# EAGLE design AstroEQ (EAGLE 6.0)
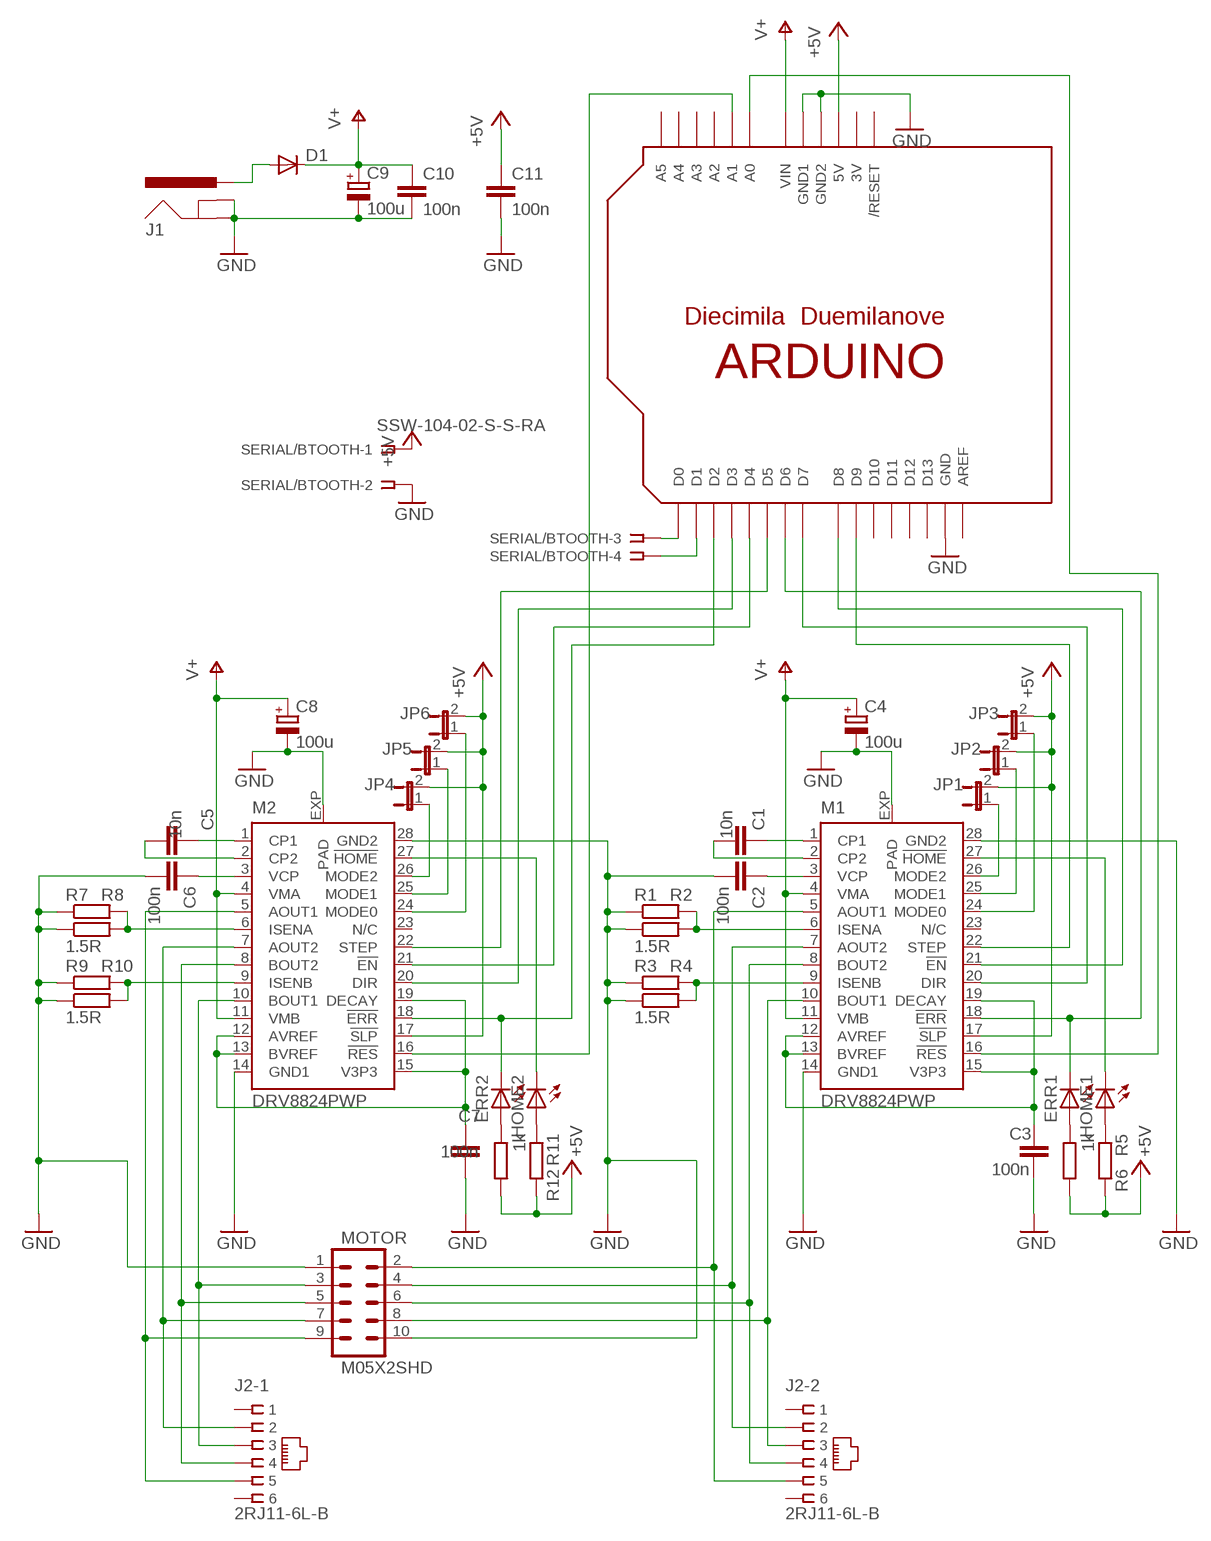
[diagram p0: schematic, sheet 1]

## Parts
C1  10n  C-EUC0603K  [C0603K]
C2  100n  C-EUC0603K  [C0603K]
C3  100n  C-EUC0603K  [C0603K]
C4  100u  CPOL-EUC/6032-28R  [C/6032-28R]
C5  10n  C-EUC0603K  [C0603K]
C6  100n  C-EUC0603K  [C0603K]
C7  100n  C-EUC0603K  [C0603K]
C8  100u  CPOL-EUC/6032-28R  [C/6032-28R]
C9  100u  CPOL-EUC/6032-28R  [C/6032-28R]
C10  100n  C-EUC0603K  [C0603K]
C11  100n  C-EUC0603K  [C0603K]
D1  DIODESMA-ALT  [SMA-DIODE_ALT]
ERR1  LEDCHIP-LED0603  [CHIP-LED0603]
ERR2  LEDCHIP-LED0603  [CHIP-LED0603]
HOME1  LEDCHIP-LED0603  [CHIP-LED0603]
HOME2  LEDCHIP-LED0603  [CHIP-LED0603]
J1  POWER_JACKPTH  [POWER_JACK_PTH]
J2  2RJ11-6L-B  [2RJ11]
JP1  JUMPER-2SMD-NO  [SJ_2S-NO]
JP2  JUMPER-2SMD-NO  [SJ_2S-NO]
JP3  JUMPER-2SMD-NO  [SJ_2S-NO]
JP4  JUMPER-2SMD-NO  [SJ_2S-NO]
JP5  JUMPER-2SMD-NO  [SJ_2S-NO]
JP6  JUMPER-2SMD-NO  [SJ_2S-NO]
M1  DRV8824PWP  [HTSSOP28PWP]
M2  DRV8824PWP  [HTSSOP28PWP]
MOTOR  M05X2SHD  [2X5-SHROUDED]
R1  1.5R  R-EU_R2512  [R2512]
R2  1.5R  R-EU_R2512  [R2512]
R3  1.5R  R-EU_R2512  [R2512]
R4  1.5R  R-EU_R2512  [R2512]
R5  1k  R-EU_R0603  [R0603]
R6  1k  R-EU_R0603  [R0603]
R7  1.5R  R-EU_R2512  [R2512]
R8  1.5R  R-EU_R2512  [R2512]
R9  1.5R  R-EU_R2512  [R2512]
R10  1.5R  R-EU_R2512  [R2512]
R11  1k  R-EU_R0603  [R0603]
R12  1k  R-EU_R0603  [R0603]
SERIAL/BTOOTH  SSW-104-02-S-S-RA  [SSW-104-02-S-S-RA]
U$1  ARDUINOUNO  [ARDUINO]

## Nets
3.3V-1: C3.1 M1.12(AVREF) M1.13(BVREF) M1.15(V3P3) M1.19(DECAY)
3.3V-2: C7.1 M2.12(AVREF) M2.13(BVREF) M2.15(V3P3) M2.19(DECAY)
!EN-1: M1.21(!EN) U$1.D8
!EN-2: M2.21(!EN) U$1.D4
!ERR-1: M1.16(!RES) U$1.A0
!ERR-2: ERR2.C M2.18(!ERR) U$1.D2
!HOME-1: HOME1.C M1.27(!HOME)
!HOME-2: HOME2.C M2.27(!HOME)
!RST-1: ERR1.C M1.18(!ERR) U$1.D6
!RST-2: M2.16(!RES) U$1.A1
+5V: C11.1 JP1.2 JP2.2 JP3.2 JP4.2 JP5.2 JP6.2 M1.17(!SLP) M2.17(!SLP) R5.2 R6.2 R11.2 R12.2 SERIAL/BTOOTH.1 U$1.5V
A1-1: J2.2-5 M1.5(AOUT1) MOTOR.2
A1-2: J2.1-5 M2.5(AOUT1) MOTOR.9
A2-1: J2.2-2 M1.7(AOUT2) MOTOR.4
A2-2: J2.1-2 M2.7(AOUT2) MOTOR.7
B1-1: J2.2-3 M1.10(BOUT1) MOTOR.8
B1-2: J2.1-3 M2.10(BOUT1) MOTOR.3
B2-1: J2.2-4 M1.8(BOUT2) MOTOR.6
B2-2: J2.1-4 M2.8(BOUT2) MOTOR.5
CP1-1: C1.1 M1.1(CP1)
CP1-2: C5.1 M2.1(CP1)
CP2-1: C1.2 M1.2(CP2)
CP2-2: C5.2 M2.2(CP2)
DIR-1: M1.20(DIR) U$1.D7
DIR-2: M2.20(DIR) U$1.D3
GND: C2.2 C3.2 C4.- C6.2 C7.2 C8.- C9.- C10.2 C11.2 J1.GND J1.GNDBREAK M1.14(GND1) M1.28(GND2) M1.EXP(PAD) M2.14(GND1) M2.28(GND2) M2.EXP(PAD) MOTOR.1 MOTOR.10 R1.1 R2.1 R3.1 R4.1 R7.1 R8.1 R9.1 R10.1 SERIAL/BTOOTH.2 U$1.GND U$1.GND1 U$1.GND2
ISENA-1: M1.6(ISENA) R1.2 R2.2
ISENA-2: M2.6(ISENA) R7.2 R8.2
ISENB-1: M1.9(ISENB) R3.2 R4.2
ISENB-2: M2.9(ISENB) R9.2 R10.2
LED1: ERR1.A R6.1
LED2: HOME1.A R5.1
LED3: ERR2.A R12.1
LED4: HOME2.A R11.1
M0-1: JP3.1 M1.24(MODE0)
M0-2: JP6.1 M2.24(MODE0)
M1-1: JP2.1 M1.25(MODE1)
M1-2: JP5.1 M2.25(MODE1)
M2-1: JP1.1 M1.26(MODE2)
M2-2: JP4.1 M2.26(MODE2)
N$7: D1.A J1.PWR
RX: SERIAL/BTOOTH.3 U$1.D0
STEP-1: M1.22(STEP) U$1.D9
STEP-2: M2.22(STEP) U$1.D5
TX: SERIAL/BTOOTH.4 U$1.D1
V+: C4.+ C8.+ C9.+ C10.1 D1.C M1.4(VMA) M1.11(VMB) M2.4(VMA) M2.11(VMB) U$1.VIN
VCP-1: C2.1 M1.3(VCP)
VCP-2: C6.1 M2.3(VCP)
Unconnected: J2.1-1 J2.1-6 J2.2-1 J2.2-6 M1.23(N/C) M2.23(N/C) U$1.A2 U$1.A3 U$1.A4 U$1.A5 U$1.AREF U$1.D10 U$1.D11 U$1.D12 U$1.D13 U$1.RESET(/RESET)

## Power pins joined to a net without a drawn wire
3V: U$1.3V

## Library data of the parts
C1-C3 C5-C7 C10 C11 = resistor:C-EU: CAPACITOR, European symbol
C4 C8 C9 = resistor:CPOL-EU: POLARIZED CAPACITOR, European symbol
D1 = SparkFun:DIODE: Diode These are standard reverse protection diodes and small signal diodes. SMA package can handle up to about 1A. SOD-323 can handle about 200mA. What the SOD-323 package when ordering, there are some mfgs out there that are 5-pin packages.
ERR1 ERR2 HOME1 HOME2 = led:LED: LED OSRAM: - CHIPLED LG R971, LG N971, LY N971, LG Q971, LY Q971, LO R971, LY R971 LH N974, LH R974 LS Q976, LO Q976, LY Q976 LO Q996 - Hyper CHIPLED LW Q18S LB Q993, LB Q99A, LB R99A - SideLED LS A670, LO A670, LY A670, LG A670, LP A670 LB A673, LV A673, LT A673, LW A673 LH A674 LY A675 LS A676, LA A676, LO A676, LY A676, LW A676 LS A679, LY A679, LG A679 - Hyper Micro SIDELED® LS Y876, LA Y876, LO Y876, LY Y876 LT Y87S - SmartLED LW L88C, LW L88S LB L89C, LB L89S, LG L890 LS L89K, LO L89K, LY L89K LS L896, LA L896, LO L896, LY L896 - TOPLED LS T670, LO T670, LY T670, LG T670, LP T670 LSG T670, LSP T670, LSY T670, LOP T670, LYG T670 LG T671, LOG T671, LSG T671 LB T673, LV T673, LT T673, LW T673 LH T674 LS T676, LA T676, LO T676, LY T676, LB T676, LH T676, LSB T676, LW T676 LB T67C, LV T67C, LT T67C, LS T67K, LO T67K, LY T67K, LW E67C LS E67B, LA E67B, LO E67B, LY E67B, LB E67C, LV E67C, LT E67C LW T67C LS T679, LY T679, LG T679 LS T770, LO T770, LY T770, LG T770, LP T770 LB T773, LV T773, LT T773, LW T773 LH T774 LS E675, LA E675, LY E675, LS T675 LS T776, LA T776, LO T776, LY T776, LB T776 LHGB T686 LT T68C, LB T68C - Hyper Mini TOPLED® LB M676 - Mini TOPLED Santana® LG M470 LS M47K, LO M47K, LY M47K Source: http://www.osram.convergy.de LUXEON: - LUMILED® LXK2-PW12-R00, LXK2-PW12-S00, LXK2-PW14-U00, LXK2-PW14-V00 LXK2-PM12-R00, LXK2-PM12-S00, LXK2-PM14-U00 LXK2-PE12-Q00, LXK2-PE12-R00, LXK2-PE12-S00, LXK2-PE14-T00, LXK2-PE14-U00 LXK2-PB12-K00, LXK2-PB12-L00, LXK2-PB12-M00, LXK2-PB14-N00, LXK2-PB14-P00, LXK2-PB14-Q00 LXK2-PR12-L00, LXK2-PR12-M00, LXK2-PR14-Q00, LXK2-PR14-R00 LXK2-PD12-Q00, LXK2-PD12-R00, LXK2-PD12-S00 LXK2-PH12-R00, LXK2-PH12-S00 LXK2-PL12-P00, LXK2-PL12-Q00, LXK2-PL12-R00 Source: www.luxeon.com KINGBRIGHT: KA-3528ASYC Source: www.kingbright.com
J1 = SparkFun:POWER_JACK: Power Jack This is the standard 5.5mm barrel jack for power. The PTH is the most common, proven, reliable, footprint. All others are experimental. The Slot footprint only works if the mill layer is transmitted to the PCB fab house so be warned. Spark Fun Electronics SKU : PRT-00119. Mating wall wart : TOL-00298 (and others)
J2 = con-tycoelectronics:2RJ11-6L-B: CORCOM Modular RJ Jacks L - Ganged Series Source: www.tycoelectronics.com .. ENG_DS_1654001_1099_RJ_L_0507.pdf; MF: TYCO ELECTRONICS; MPN: 2RJ11-6L-B; OC_FARNELL: unknown; OC_NEWARK: 48F3954
JP1-JP6 = SparkFun:JUMPER-2: Jumper Basic 0.1" spaced jumper. Use with breakaway headers.
M1 M2 = texas:DRV8824
MOTOR = SparkFun:M05X2: Header 5x2 Standard 10-pin dual row 0.1" header. Commonly used with AVR-ISP. Use with Spark Fun Electronics SKU: PRT-00778
R1-R12 = resistor:R-EU_: RESISTOR, European symbol
SERIAL/BTOOTH = con-samtec:SSW-104-02-S-S: THROUGH-HOLE .025" SQ POST SOCKET Source: Samtec SSW.pdf; MPN: SSW-104-02-S-S-RA; OC_FARNELL: unknown; OC_NEWARK: 11P9385
U$1 = adafruit:ARDUINO: Arduino Diecimila/Duemilanove Make a shield with ease, this package has all the named pins as well as the two mounting drill holes and an outline of the USB and DC power connector. The outline is on the DIMENSION layer, so if your board house uses it they will cut the outline to match. http://www.ladyada.net/library/pcb/eaglelibrary.html

## Board
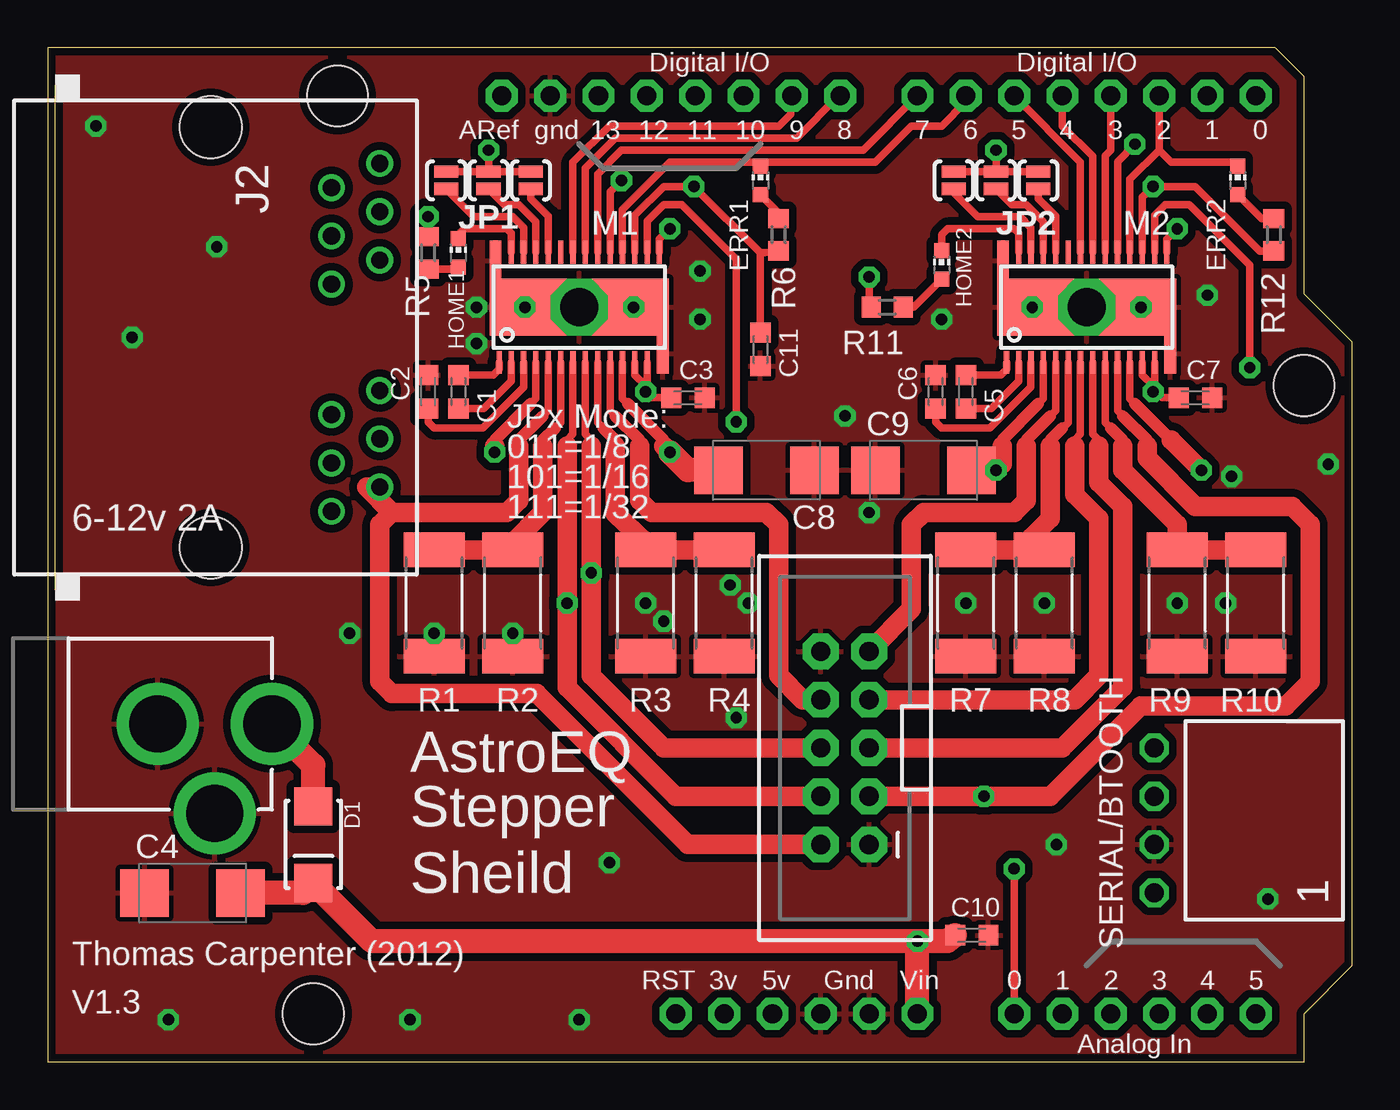
[diagram p1: board, top side]
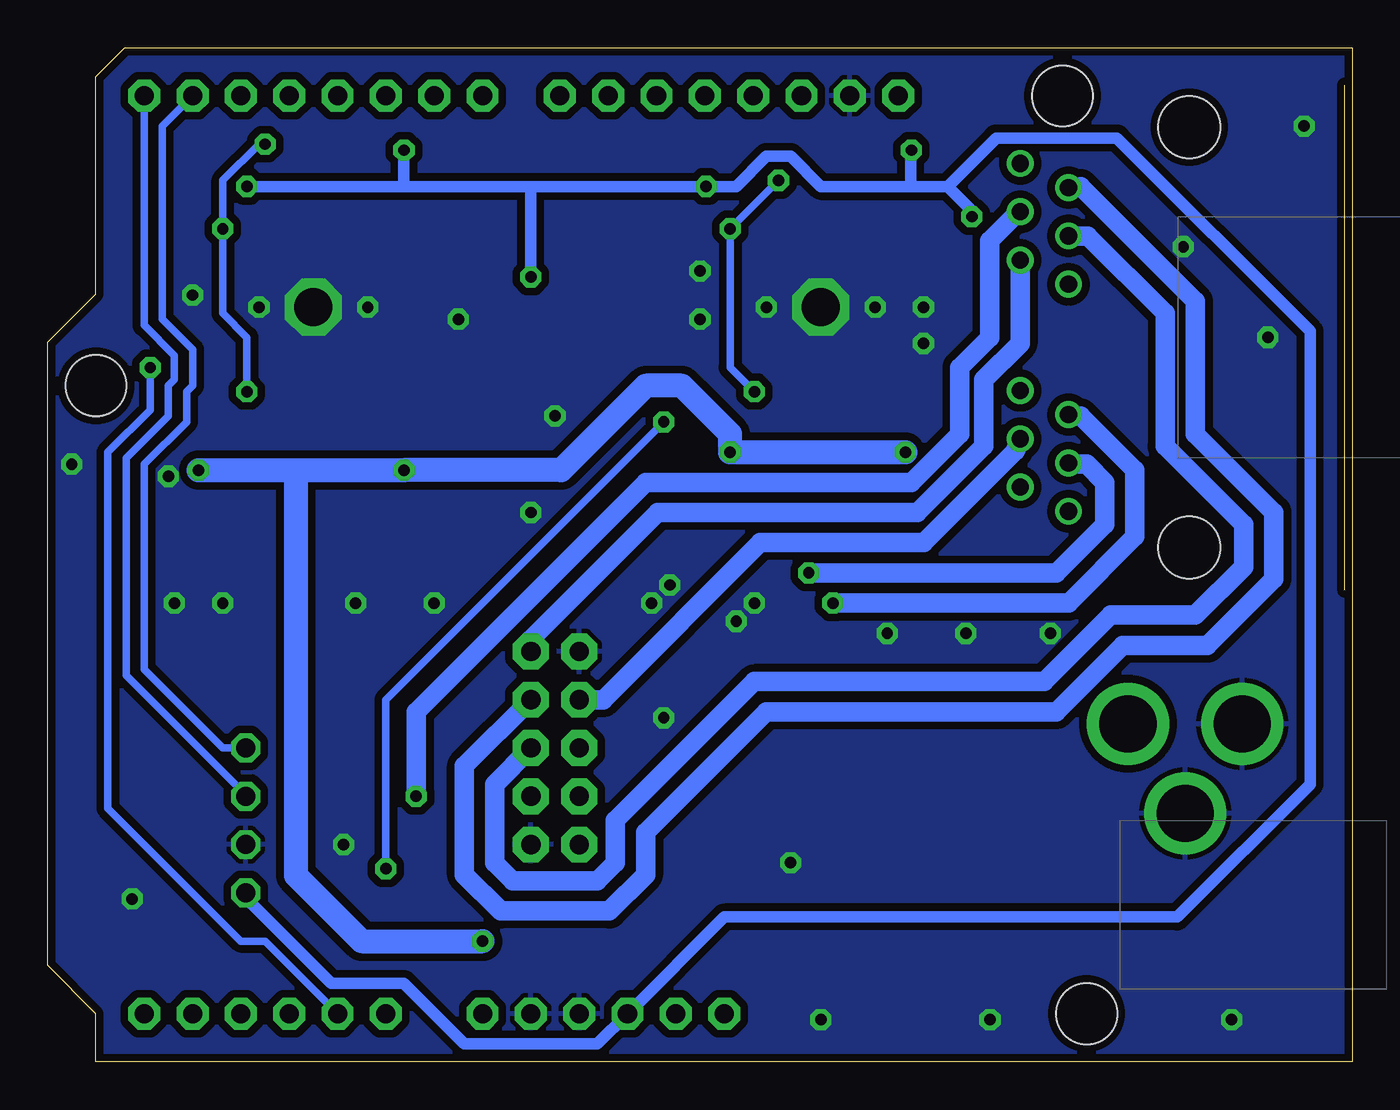
[diagram p2: board, bottom side, seen from below]

Size 68.58 x 53.34 mm. Coordinates in mm from the lower left corner, seen from the top.
Copper layers (1*16): Top 0.035mm / dielectric 1.5mm / Bottom 0.035mm
Design rules: minimum track width 0.2mm, minimum drill 0.4mm, track to track 0.2mm, track to pad 0.2mm, pad to pad 0.2mm, via to via 0.2mm, smd to smd 0mil, copper to edge 10mil, drill to drill 0.2mm, minimum pad ring 10mil, minimum via ring 10mil, stop-mask expansion 0.125mm, vias tented up to drill 0mil, thermal gap 10mil

### Footprints (pad centres in the part's own frame; a part is rotated, then mirrored left to right if it is on the bottom)
C0603K = smd 1.05 x 1.08: 1 -0.875,0; 2 0.875,0
C/6032-28R = smd 2.55 x 2.5: + 2.525,0; - -2.525,0
SMA-DIODE_ALT = smd 2 x 2: A -2,0; C 2,0
CHIP-LED0603 = smd 0.8 x 0.8: A 0,-0.75; C 0,0.75
POWER_JACK_PTH = drill 2.997 pad 4.318: GND 0,7.7; GNDBREAK 4.7,10.7; PWR 0,13.7
2RJ11 = drill 0.9 pad 1.4: 1-1 -9.144,8.89; 1-2 -7.874,6.35; 1-3 -6.604,8.89; 1-4 -5.334,6.35; 1-5 -4.064,8.89; 1-6 -2.794,6.35; 2-1 2.794,8.89; 2-2 4.064,6.35; 2-3 5.334,8.89; 2-4 6.604,6.35; 2-5 7.874,8.89; 2-6 9.144,6.35 | hole 3.251: -11.049,0; 11.049,0
SJ_2S-NO = smd 0.635 x 1.27: 1 -0.45,0; 2 0.45,0
HTSSOP28PWP = smd 0.27 x 1.2: 1 -4.21,-2.9; 2 -3.575,-2.9; 3 -2.925,-2.9; 4 -2.275,-2.9; 5 -1.625,-2.9; 6 -0.975,-2.9; 7 -0.325,-2.9; 8 0.325,-2.9; 9 0.975,-2.9; 10 1.625,-2.9; 11 2.275,-2.9; 12 2.925,-2.9; 13 3.575,-2.9; 15 4.21,2.9; 16 3.575,2.9; 17 2.925,2.9; 18 2.275,2.9; 19 1.625,2.9; 20 0.975,2.9; 21 0.325,2.9; 22 -0.325,2.9; 23 -0.975,2.9; 24 -1.625,2.9; 25 -2.275,2.9; 26 -2.925,2.9; 27 -3.575,2.9 | smd 0.61 x 2.1: 14 4.395,-2.45; 28 -4.395,2.45 | smd 9.4 x 3: EXP 0,0
2X5-SHROUDED = drill 1.016 pad 1.88 octagon: 1 -1.27,5.08; 2 1.27,5.08; 3 -1.27,2.54; 4 1.27,2.54; 5 -1.27,0; 6 1.27,0; 7 -1.27,-2.54; 8 1.27,-2.54; 9 -1.27,-5.08; 10 1.27,-5.08
R2512 = smd 1.8 x 3.2: 1 -2.8,0; 2 2.8,0
R0603 = smd 1 x 1.1: 1 -0.85,0; 2 0.85,0
SSW-104-02-S-S-RA = drill 1 pad 1.5 octagon: 1 -3.81,1.524; 2 -1.27,1.524; 3 1.27,1.524; 4 3.81,1.524
ARDUINO = drill 1 pad 1.676 octagon: 3V 35.56,2.54; 5V 38.1,2.54; A0 50.8,2.54; A1 53.34,2.54; A2 55.88,2.54; A3 58.42,2.54; A4 60.96,2.54; A5 63.5,2.54; AREF 23.876,50.8; D0 63.5,50.8; D1 60.96,50.8; D2 58.42,50.8; D3 55.88,50.8; D4 53.34,50.8; D5 50.8,50.8; D6 48.26,50.8; D7 45.72,50.8; D8 41.656,50.8; D9 39.116,50.8; D10 36.576,50.8; D11 34.036,50.8; D12 31.496,50.8; D13 28.956,50.8; GND 26.416,50.8; GND1 43.18,2.54; GND2 40.64,2.54; RESET 33.02,2.54; VIN 45.72,2.54 | hole 3.2: 15.24,50.8; 66.04,35.56; 13.97,2.54

### Placement (x,y rotation side)
C1  21.59,35.24 270 top
C2  20,35.24 90 top
C3  33.66,34.92 0 top
C4  7.62,8.89 0 top
C5  48.26,35.24 270 top
C6  46.67,35.24 90 top
C7  60.33,34.92 0 top
C8  37.78,31.11 180 top
C9  46.04,31.11 0 top
C10  48.58,6.67 0 top
C11  37.47,37.47 270 top
D1  13.97,11.43 270 top
ERR1  37.47,46.35 0 top
ERR2  62.55,46.35 0 top
HOME1  21.59,42.55 0 top
HOME2  46.99,41.91 0 top
J1  -1.91,17.78 270 top
J2  8.57,38.1 270 top
JP1  20.95,46.35 90 top
JP2  23.18,46.35 90 top
JP3  25.4,46.35 90 top
JP4  47.62,46.35 90 top
JP5  49.85,46.35 90 top
JP6  52.07,46.35 90 top
M1  27.94,39.69 0 top
M2  54.61,39.69 0 top
MOTOR  41.91,16.51 180 top
R1  20.32,24.13 90 top
R2  24.45,24.13 90 top
R3  31.43,24.13 90 top
R4  35.56,24.13 90 top
R5  20,42.55 90 top
R6  38.42,43.5 270 top
R7  48.26,24.13 90 top
R8  52.39,24.13 90 top
R9  59.37,24.13 90 top
R10  63.5,24.13 90 top
R11  44.13,39.69 180 top
R12  64.45,43.5 270 top
SERIAL/BTOOTH  59.69,12.7 90 top
U$1  0,0 0 top

### Tracks (layer width: path | path; a pad name or v marks a point on that pad's centre or on a via)
3.3V-1  (via drill 0.6)
  Top 0.406: M1.19 29.57,45.76 v30.16,46.35 | M1.12 30.86,36.13 31.43,35.56 v31.43,35.24 | M1.13 31.52,35.33 v31.43,35.24 | M1.15 32.15,43.26 v32.7,43.81 | v31.43,35.24 31.75,34.92 C3.1
  Bottom 0.406: v31.43,35.24 32.7,36.51 v32.7,43.81 v30.16,46.35
3.3V-2  (via drill 0.6)
  Top 0.406: M2.19 56.23,47.34 v57.15,48.26 | M2.12 57.53,36.13 58.1,35.56 v58.1,35.24 58.19,35.33 | M2.13 58.19,35.33 | M2.15 58.82,43.26 v59.37,43.81 | 58.19,35.33 58.59,34.92 C7.1
  Bottom 0.406: v57.15,48.26 57.47,48.26 59.37,46.35 v59.37,43.81 59.37,39.37 58.1,38.1 v58.1,35.24
!EN-1
  Top 0.406: M1.21 28.27,47 29.84,48.58 39.37,48.58 41.59,50.8 U$1.D8
!EN-2
  Top 0.406: M2.21 54.94,47.62 53.34,49.21 U$1.D4
!ERR-1  (via drill 0.6)
  Top 0.406: M1.16 31.52,44.22 32.38,45.09 33.34,45.09 36.2,42.23 v36.2,33.66 | v50.8,10.16 U$1.A0
  Bottom 0.406: v36.2,33.66 50.8,19.05 v50.8,10.16
!ERR-2
  Top 0.406: M2.18 56.88,46.41 58.42,47.94 | 58.42,47.94 U$1.D2 | 58.42,47.94 59.05,47.31 62.23,47.31 ERR2.C
!HOME-1
  Top 0.406: M1.27 24.36,43.58 24.13,43.81 21.91,43.81 21.59,43.5 HOME1.C
!HOME-2
  Top 0.406: M2.27 51.03,43.58 50.8,43.81 47.31,43.81 46.99,43.5 HOME2.C
!RST-1
  Top 0.406: M1.18 30.21,44.82 32.7,47.31 37.15,47.31 | 37.15,47.31 43.5,47.31 45.4,49.21 46.99,49.21 48.26,50.48 U$1.D6 | ERR1.C 37.15,47.31
!RST-2  (via drill 0.6)
  Top 0.406: M2.16 58.19,44.53 58.74,45.09 60.01,45.09 63.18,41.91 v63.18,36.51
  Bottom 0.406: v63.18,36.51 63.18,34.29 65.41,32.07 65.41,13.34 58.42,6.35 57.15,6.35 U$1.A1
+5V  (via drill 0.6)
  Top 0.406: M1.17 30.86,44.52 32.38,46.04 v33.97,46.04 37.47,42.55 | M2.17 57.53,45.47 v58.1,46.04 60.33,46.04 63.72,42.65 R12.2 | JP4.2 JP5.2 | JP6.2 JP5.2 | JP5.2 v49.85,47.94 | JP1.2 JP2.2 | JP3.2 JP2.2 | JP2.2 v23.18,47.94 | 37.47,42.55 C11.1 | R6.2 37.68,42.55 37.47,42.55 | R5.2 v20,44.45 | R11.2 43.18,39.79 v43.18,41.27
  Bottom 0.61: 43.18,46.04 v33.97,46.04 32.38,46.04 30.8,47.62 29.53,47.62 27.94,46.04 23.21,46.04 | 43.18,46.04 49.85,46.04 | 49.85,46.04 v58.1,46.04 | v49.85,47.94 49.85,46.04 | 23.21,46.04 21.27,46.04 | 23.21,46.04 23.21,47.91 v23.18,47.94 | v43.18,41.27 43.18,46.04 | 21.27,46.04 18.73,48.58 12.38,48.58 2.22,38.42 2.22,14.61 9.21,7.62 33.02,7.62 U$1.5V 39.69,0.95 46.67,0.95 49.85,4.13 53.66,4.13 58.17,8.64 SERIAL/BTOOTH.1 | 21.27,46.04 20,44.77 v20,44.45
A1-1
  Top 0.406: M1.5 26.32,34.25 26.04,33.97 | 24.77,32.38 24.77,32.7
  Top 0.61: 26.04,33.97 24.77,32.7
  Top 1.016: 18.1,28.89 17.46,28.26 17.46,20 18.1,19.37 25.72,19.37 33.66,11.43 MOTOR.2 | 18.1,28.89 24.13,28.89 24.77,29.53 24.77,32.38 | J2.2-5 16.76,30.23 18.1,28.89
A1-2
  Top 0.406: M2.5 52.98,34.25 52.7,33.97 | 51.44,32.7 51.44,32.38
  Top 0.61: 52.7,33.97 51.44,32.7
  Top 1.016: 51.44,32.38 51.44,29.53 50.8,28.89 46.04,28.89 45.4,28.26 45.4,23.81 MOTOR.9
  Bottom 1.016: J2.1-5 17.46,37.78 19.37,35.88 19.37,32.38 22.86,28.89 36.51,28.89 43.18,22.23 MOTOR.9
A2-1  (via drill 0.6)
  Top 0.406: M1.7 27.61,33.01 27.3,32.7 27.3,32.38
  Top 1.016: 27.3,32.38 v27.3,24.13 27.3,19.68 33.02,13.97 MOTOR.4
  Bottom 1.016: v27.3,24.13 14.92,24.13 11.43,27.62 11.43,31.11 14.29,33.97 14.92,33.97 J2.2-2
A2-2
  Top 0.406: M2.7 54.28,33.01 53.98,32.7 53.98,32.38
  Top 1.016: 53.98,32.38 53.98,29.84 55.24,28.57 55.24,20.32 53.98,19.05 MOTOR.7
  Bottom 1.016: J2.1-2 14.29,46.04 8.26,40.01 8.26,33.02 4.13,28.89 4.13,25.4 7.62,21.91 12.06,21.91 15.56,18.41 30.8,18.41 37.15,12.06 37.15,9.84 39.05,7.94 44.77,7.94 46.67,9.84 46.67,15.56 MOTOR.7
B1-1
  Top 0.406: M1.10 29.57,34.25 29.84,33.97 | 31.11,32.7 31.11,32.38
  Top 0.61: 29.84,33.97 31.11,32.7
  Top 1.016: 31.11,32.38 31.11,29.53 31.75,28.89 37.78,28.89 38.42,28.26 38.42,20.32 39.69,19.05 MOTOR.8
  Bottom 1.016: J2.2-3 17.72,32.13 22.54,27.3 31.11,27.3 39.37,19.05 MOTOR.8
B1-2  (via drill 0.6)
  Top 0.406: M2.10 56.23,34.25 56.52,33.97 | 57.78,32.7 57.78,32.38
  Top 0.61: 56.52,33.97 57.78,32.7
  Top 1.016: 57.78,32.38 57.78,31.75 60.33,29.21 65.41,29.21 66.36,28.26 66.36,20 65.09,18.73 57.47,18.73 52.7,13.97 v49.21,13.97 MOTOR.3
  Bottom 1.016: J2.1-3 17.53,44.7 19.05,43.18 19.05,38.1 20.64,36.51 20.64,33.02 23.18,30.48 37.15,30.48 49.21,18.41 v49.21,13.97
B2-1  (via drill 0.6)
  Top 0.406: M1.8 28.27,33.01 28.57,32.7 28.57,32.38
  Top 1.016: 28.57,32.38 v28.57,25.72 28.57,20.32 32.38,16.51 MOTOR.6
  Bottom 1.016: v28.57,25.72 15.56,25.72 13.02,28.26 13.02,30.48 13.97,31.43 14.54,31.43 J2.2-4
B2-2
  Top 0.406: M2.8 54.94,33.01 55.24,32.7 55.24,32.38
  Top 1.016: 55.24,32.38 55.24,30.48 56.52,29.21 56.52,19.68 53.34,16.51 MOTOR.5
  Bottom 1.016: J2.1-4 13.91,43.43 9.84,39.37 9.84,32.38 5.71,28.26 5.71,26.04 8.26,23.5 12.7,23.5 16.19,20 31.43,20 38.73,12.7 38.73,10.48 39.69,9.53 44.13,9.53 45.09,10.48 45.09,14.61 MOTOR.5
CP1-1
  Top 0.406: M1.1 23.73,36.43 23.42,36.12 C1.1
CP1-2
  Top 0.406: M2.1 50.4,36.43 50.09,36.12 C5.1
CP2-1
  Top 0.406: M1.2 24.36,35.8 22.94,34.37 C1.2
CP2-2
  Top 0.406: M2.2 51.03,35.8 49.61,34.37 C5.2
DIR-1
  Top 0.406: U$1.D7 42.86,47.94 30.16,47.94 28.91,46.7 M1.20
DIR-2
  Top 0.406: M2.20 55.59,47.65 55.88,47.94 U$1.D3
GND  (via drill 0.6, 2)
  other vias: 20.32,22.54 24.45,22.54 31.43,24.13 36.83,24.13 25.08,39.69 30.8,39.69 51.75,39.69 57.47,39.69 48.26,24.13 52.39,24.13 59.37,24.13 61.91,24.13 54.61,39.69 27.94,39.69 64.14,8.57 53.02,11.43 29.53,10.48 4.45,38.1 8.89,42.86 2.54,49.21 19.05,2.22 27.94,2.22 6.35,2.22 67.31,31.43 62.23,30.8 43.18,28.89 41.91,33.97 46.99,39.05 60.96,40.32 34.29,39.05 34.29,41.59 22.54,37.78 22.54,39.69 35.88,25.08 32.38,23.18 36.2,18.1 15.88,22.54
  pour Bottom (isolate 0.406): 0,53.34 68.58,53.34 68.58,0 0,0
  pour Top (isolate 0.406): 0,53.34 68.58,53.34 68.58,0 0,0
ISENA-1
  Top 0.406: M1.6 26.96,33.63 26.67,33.34 | 26.04,32.7 26.04,32.38
  Top 0.61: 26.67,33.34 26.04,32.7
  Top 1.016: R1.2 R2.2 24.39,27.25 26.04,28.89 26.04,32.38
ISENA-2
  Top 0.406: M2.6 53.63,33.63 53.34,33.34 | 52.7,32.7 52.7,32.38
  Top 0.61: 53.34,33.34 52.7,32.7
  Top 1.016: R7.2 R8.2 51.7,27.57 52.7,28.57 52.7,32.38
ISENB-1
  Top 0.406: M1.9 28.91,33.63 29.21,33.34 | 29.84,32.7 29.84,32.38
  Top 0.61: 29.21,33.34 29.84,32.7
  Top 1.016: R4.2 R3.2 31.43,27.3 29.84,28.84 29.84,32.38
ISENB-2
  Top 0.406: M2.9 55.59,33.63 55.88,33.34 | 56.52,32.7 56.52,32.38
  Top 0.61: 55.88,33.34 56.52,32.7
  Top 1.016: R10.2 R9.2 59.37,28.26 56.52,31.11 56.52,32.38
LED1
  Top 0.406: ERR1.A 38.62,44.45 38.42,44.45 R6.1
LED2
  Top 0.406: HOME1.A 21.39,41.59 21.59,41.91 21.59,41.7 R5.1
LED3
  Top 0.406: ERR2.A 63.8,44.35 R12.1
LED4
  Top 0.406: HOME2.A 45.52,39.69 R11.1
M0-1
  Top 0.406: M1.24 26.32,44.49 25.4,45.4 JP3.1
M0-2
  Top 0.406: M2.24 52.98,44.49 52.07,45.4 JP6.1
M1-1
  Top 0.406: M1.25 25.66,44.19 24.77,45.09 24,45.09 JP2.1
M1-2
  Top 0.406: M2.25 52.34,44.19 51.44,45.09 50.67,45.09 JP5.1
M2-1
  Top 0.406: M1.26 25.02,43.88 24.45,44.45 22.41,44.45 JP1.1
M2-2
  Top 0.406: M2.26 51.69,43.88 51.12,44.45 48.9,44.45 47.94,45.4 47.62,45.72 JP4.1
N$7
  Top 1.27: D1.A 13.97,15.61 J1.PWR
RX
  Bottom 0.406: SERIAL/BTOOTH.3 58.17,14.03 64.45,20.32 64.45,31.75 62.23,33.97 62.23,35.56 61.91,35.88 61.91,37.15 63.5,38.73 U$1.D0
STEP-1
  Top 0.406: M1.22 27.61,47.3 29.53,49.21 38.42,49.21 39.05,49.85 39.05,50.74 U$1.D9
STEP-2
  Top 0.406: M2.22 54.28,47.31 U$1.D5
TX
  Bottom 0.406: SERIAL/BTOOTH.4 59.37,16.51 63.5,20.64 63.5,31.43 61.28,33.66 61.28,35.24 60.96,35.56 60.96,37.47 62.55,39.05 62.55,49.21 U$1.D1
V+  (via drill 0.6)
  Top 0.305: M1.4 25.66,35.83 | M1.11 30.21,35.83
  Top 0.406: M1.4 25.66,34.87 25.4,34.61 | M2.4 52.34,34.87 52.07,34.61 | M2.11 56.88,34.87 57.15,34.61 | M1.11 30.21,34.87 30.48,34.61 | 23.5,32.7 23.5,32.38 | 50.16,32.7 50.16,32.38 | 32.38,32.38 32.38,32.7
  Top 0.61: 25.4,34.61 23.5,32.7 | 52.07,34.61 50.16,32.7 | 30.48,34.61 32.38,32.7 | 57.15,34.61 59.05,32.7
  Top 1.016: C9.+ v49.85,31.11 50.16,31.43 50.16,32.38 | v23.5,32.07 23.5,32.38 | v32.7,32.07 32.38,32.38 | v60.64,31.11 59.05,32.7
  Top 1.27: C4.+ 13.43,8.89 D1.C 17.05,6.35 v45.72,6.35 | U$1.VIN v45.72,6.35 | C10.1 47.38,6.43 47.31,6.35 v45.72,6.35 | C8.+ 33.66,31.11 v32.7,32.07
  Bottom 1.27: v60.64,31.11 55.53,31.11 | 55.53,31.11 v49.85,31.11 41.59,31.11 37.15,35.56 35.24,35.56 32.7,33.02 v32.7,32.07 v23.5,32.07 | 55.53,31.11 55.53,9.81 52.07,6.35 v45.72,6.35
VCP-1
  Top 0.406: M1.3 25.02,35.49 22.86,33.34 20.32,33.34 20,33.66 C2.1
VCP-2
  Top 0.406: M2.3 51.69,35.49 49.53,33.34 46.99,33.34 46.67,33.66 C6.1

### Text on the board
tNames: JP1 | JP2 | JPx Mode: | 011=1/8 | 101=1/16 | 111=1/32 | 6-12v 2A | AstroEQ | Stepper | Sheild | Thomas Carpenter (2012) | V1.3
tDocu: Free | Free